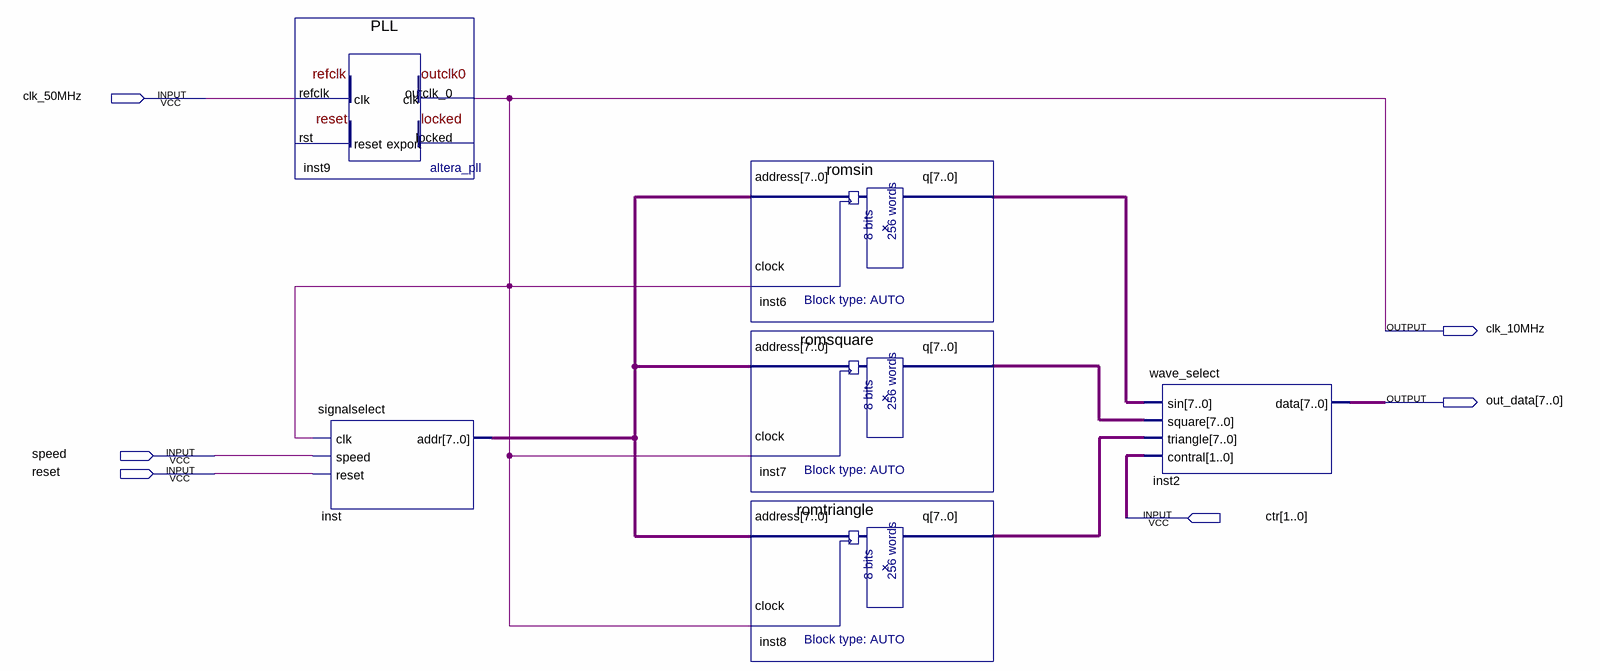
[diagram p0: schematic sheet]
// Quartus schematic Block1.bdf as structural Verilog: 6 symbols, 6 pins
module Block1 (
  input  clk_50MHz,
  input  speed,
  input  reset,
  input  [1:0] ctr,
  output clk_10MHz,
  output [7:0] out_data
);

  wire [7:0] inst6_q, inst7_q, inst8_q, inst_addr;

  PLL inst9 (.refclk(clk_50MHz), .outclk_0(clk_10MHz));  // open: rst, locked
  signalselect inst (.clk(clk_10MHz), .speed(speed), .reset(reset), .addr(inst_addr));
  romsin inst6 (.address(inst_addr), .clock(clk_10MHz), .q(inst6_q));
  romsquare inst7 (.address(inst_addr), .clock(clk_10MHz), .q(inst7_q));
  romtriangle inst8 (.address(inst_addr), .clock(clk_10MHz), .q(inst8_q));
  wave_select inst2 (.sin(inst6_q), .square(inst7_q), .triangle(inst8_q), .contral(ctr), .data(out_data));
endmodule
